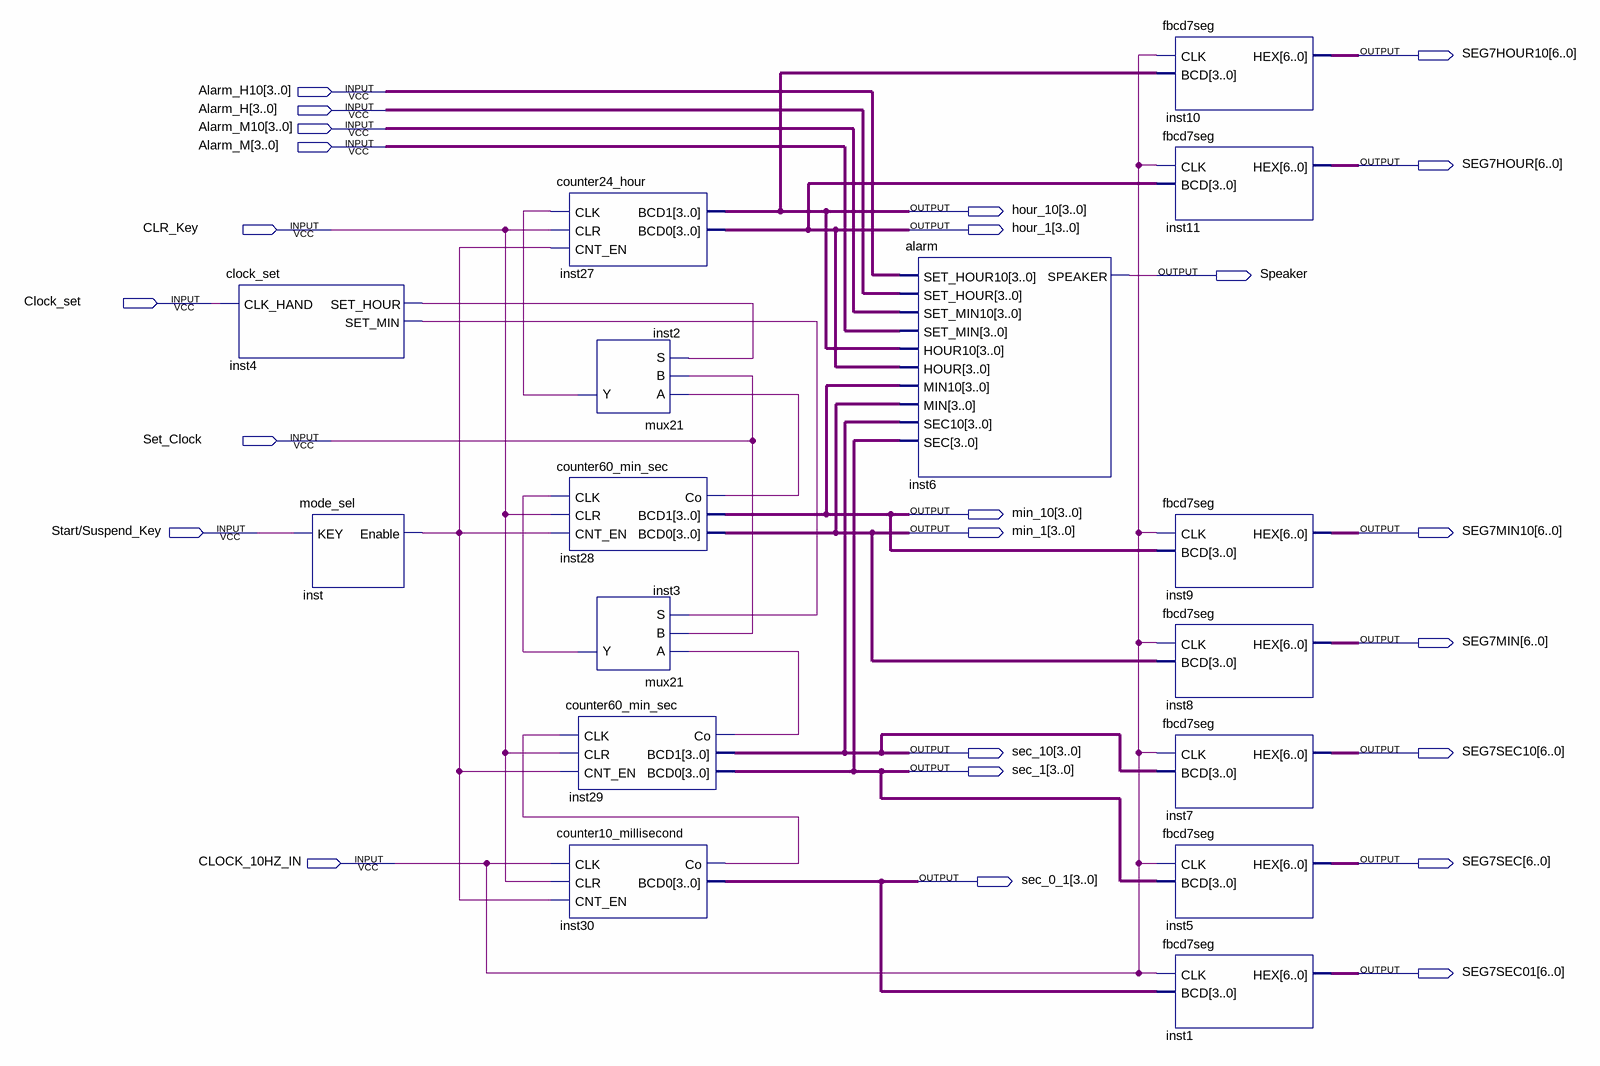
[diagram p0: schematic sheet]
// Quartus schematic clock.bdf as structural Verilog: 16 symbols, 24 pins
module clock (
  input  [3:0] Alarm_H10,
  input  [3:0] Alarm_H,
  input  [3:0] Alarm_M10,
  input  [3:0] Alarm_M,
  input  CLR_Key,
  input  Clock_set,
  input  Set_Clock,
  input  \Start/Suspend_Key ,
  input  CLOCK_10HZ_IN,
  output [6:0] SEG7HOUR10,
  output [6:0] SEG7HOUR,
  output [3:0] hour_10,
  output [3:0] hour_1,
  output Speaker,
  output [3:0] min_10,
  output [3:0] min_1,
  output [6:0] SEG7MIN10,
  output [6:0] SEG7MIN,
  output [3:0] sec_10,
  output [6:0] SEG7SEC10,
  output [3:0] sec_1,
  output [6:0] SEG7SEC,
  output [3:0] sec_0_1,
  output [6:0] SEG7SEC01
);

  wire inst2_y, inst3_y, inst4_set_hour, inst4_set_min, inst28_co, inst29_co, inst30_co, inst_enable;

  clock_set inst4 (.CLK_HAND(Clock_set), .SET_HOUR(inst4_set_hour), .SET_MIN(inst4_set_min));
  mode_sel inst (.KEY(\Start/Suspend_Key ), .Enable(inst_enable));
  counter24_hour inst27 (.CLK(inst2_y), .CLR(CLR_Key), .CNT_EN(inst_enable), .BCD1(hour_10), .BCD0(hour_1));
  mux21 inst2 (.A(inst28_co), .B(Set_Clock), .S(inst4_set_hour), .Y(inst2_y));
  counter60_min_sec inst28 (
    .CLK(inst3_y), .CLR(CLR_Key), .CNT_EN(inst_enable), .Co(inst28_co), .BCD1(min_10), .BCD0(min_1));
  mux21 inst3 (.A(inst29_co), .B(Set_Clock), .S(inst4_set_min), .Y(inst3_y));
  counter60_min_sec inst29 (
    .CLK(inst30_co), .CLR(CLR_Key), .CNT_EN(inst_enable), .Co(inst29_co), .BCD1(sec_10), .BCD0(sec_1));
  counter10_millisecond inst30 (
    .CLK(CLOCK_10HZ_IN), .CLR(CLR_Key), .CNT_EN(inst_enable), .Co(inst30_co), .BCD0(sec_0_1));
  alarm inst6 (
    .SET_HOUR10(Alarm_H10), .SET_HOUR(Alarm_H), .SET_MIN10(Alarm_M10), .SET_MIN(Alarm_M), .HOUR10(hour_10),
    .HOUR(hour_1), .MIN10(min_10), .MIN(min_1), .SEC10(sec_10), .SEC(sec_1), .SPEAKER(Speaker));
  fbcd7seg inst10 (.CLK(CLOCK_10HZ_IN), .BCD(hour_10), .HEX(SEG7HOUR10));
  fbcd7seg inst11 (.CLK(CLOCK_10HZ_IN), .BCD(hour_1), .HEX(SEG7HOUR));
  fbcd7seg inst9 (.CLK(CLOCK_10HZ_IN), .BCD(min_10), .HEX(SEG7MIN10));
  fbcd7seg inst8 (.CLK(CLOCK_10HZ_IN), .BCD(min_1), .HEX(SEG7MIN));
  fbcd7seg inst7 (.CLK(CLOCK_10HZ_IN), .BCD(sec_10), .HEX(SEG7SEC10));
  fbcd7seg inst5 (.CLK(CLOCK_10HZ_IN), .BCD(sec_1), .HEX(SEG7SEC));
  fbcd7seg inst1 (.CLK(CLOCK_10HZ_IN), .BCD(sec_0_1), .HEX(SEG7SEC01));
endmodule
